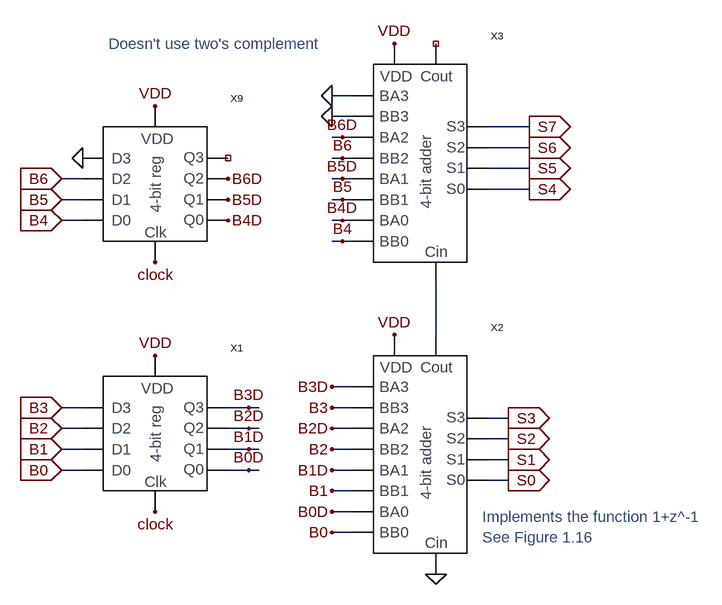
[diagram p0: schematic 7_bit_averager.asc]
7_bit_averager.asc, the LTspice schematic file:
Version 4
SHEET 1 1324 932
WIRE 48 -1072 16 -1072
WIRE 48 -1040 16 -1040
WIRE 320 -1024 256 -1024
WIRE 32 -1008 16 -1008
WIRE 48 -1008 32 -1008
WIRE 320 -992 256 -992
WIRE 32 -976 16 -976
WIRE 48 -976 32 -976
WIRE 320 -960 256 -960
WIRE -368 -944 -400 -944
WIRE 32 -944 16 -944
WIRE 48 -944 32 -944
WIRE 320 -928 256 -928
WIRE -368 -912 -400 -912
WIRE 32 -912 16 -912
WIRE 48 -912 32 -912
WIRE -368 -880 -400 -880
WIRE 32 -880 16 -880
WIRE 48 -880 32 -880
WIRE 32 -848 16 -848
WIRE 48 -848 32 -848
WIRE 176 -704 176 -784
WIRE 48 -624 16 -624
WIRE -368 -592 -400 -592
WIRE -112 -592 -144 -592
WIRE -96 -592 -112 -592
WIRE 48 -592 16 -592
WIRE 288 -576 256 -576
WIRE -368 -560 -400 -560
WIRE -112 -560 -144 -560
WIRE -96 -560 -112 -560
WIRE 48 -560 16 -560
WIRE 288 -544 256 -544
WIRE -368 -528 -400 -528
WIRE -112 -528 -144 -528
WIRE -96 -528 -112 -528
WIRE 48 -528 16 -528
WIRE 288 -512 256 -512
WIRE -368 -496 -400 -496
WIRE -112 -496 -144 -496
WIRE -96 -496 -112 -496
WIRE 48 -496 16 -496
WIRE 288 -480 256 -480
WIRE 48 -464 16 -464
WIRE 48 -432 16 -432
WIRE 48 -400 16 -400
FLAG -256 -672 VDD
FLAG -256 -432 clock
FLAG 112 -704 VDD
FLAG -400 -592 B3
IOPIN -400 -592 In
FLAG -400 -560 B2
IOPIN -400 -560 In
FLAG -400 -528 B1
IOPIN -400 -528 In
FLAG -400 -496 B0
IOPIN -400 -496 In
FLAG -112 -592 B3D
FLAG -112 -560 B2D
FLAG -112 -528 B1D
FLAG -112 -496 B0D
FLAG 288 -576 S3
IOPIN 288 -576 Out
FLAG 288 -544 S2
IOPIN 288 -544 Out
FLAG 288 -512 S1
IOPIN 288 -512 Out
FLAG 288 -480 S0
IOPIN 288 -480 Out
FLAG 16 -592 B3
FLAG 16 -528 B2
FLAG 16 -464 B1
FLAG 16 -400 B0
FLAG 16 -432 B0D
FLAG 16 -496 B1D
FLAG 16 -560 B2D
FLAG 16 -624 B3D
FLAG 176 -336 0
FLAG 320 -928 S4
IOPIN 320 -928 Out
FLAG 32 -880 B4D
FLAG 32 -848 B4
FLAG 112 -1152 VDD
FLAG 320 -960 S5
IOPIN 320 -960 Out
FLAG 32 -944 B5D
FLAG 32 -912 B5
FLAG 320 -1024 S7
IOPIN 320 -1024 Out
FLAG 320 -992 S6
IOPIN 320 -992 Out
FLAG 32 -1008 B6D
FLAG 32 -976 B6
FLAG -256 -1056 VDD
FLAG -256 -816 clock
FLAG -400 -880 B4
IOPIN -400 -880 In
FLAG -400 -912 B5
IOPIN -400 -912 In
FLAG -400 -944 B6
IOPIN -400 -944 In
FLAG -368 -976 0
FLAG -144 -944 B6D
FLAG -144 -912 B5D
FLAG -144 -880 B4D
FLAG 16 -1072 0
FLAG 16 -1040 0
SYMBOL 4_bit_register -336 -464 R0
SYMATTR InstName X1
SYMBOL 4_bit_adder 80 -368 R0
SYMATTR InstName X2
SYMBOL 4_bit_register -336 -848 R0
SYMATTR InstName X9
SYMBOL 4_bit_adder 80 -816 R0
SYMATTR InstName X3
TEXT 248 -424 Left 0 ;Implements the function 1+z^-1\nSee Figure 1.16
TEXT -328 -1152 Left 0 ;Doesn't use two's complement

The netlist it stands for:
* 7_bit_averager.asc
XX1 B0 B1 B2 B3 B0D B1D B2D B3D clock VDD 4_bit_register  ; pins D0 D1 D2 D3 Q0 Q1 Q2 Q3 Clk VDD
XX2 B0D B0 B1D B1 B2D B2 B3D B3 S0 S1 S2 S3 0 N001 VDD 4_bit_adder  ; pins BA0 BB0 BA1 BB1 BA2 BB2 BA3 BB3 S0 S1 S2 S3 Cin Cout VDD
XX9 B4 B5 B6 0 B4D B5D B6D NC_01 clock VDD 4_bit_register  ; pins D0 D1 D2 D3 Q0 Q1 Q2 Q3 Clk VDD
XX3 B4D B4 B5D B5 B6D B6 0 0 S4 S5 S6 S7 N001 NC_02 VDD 4_bit_adder  ; pins BA0 BB0 BA1 BB1 BA2 BB2 BA3 BB3 S0 S1 S2 S3 Cin Cout VDD
* Implements the function 1+z^-1
* See Figure 1.16
* Doesn't use two's complement
.backanno
.end